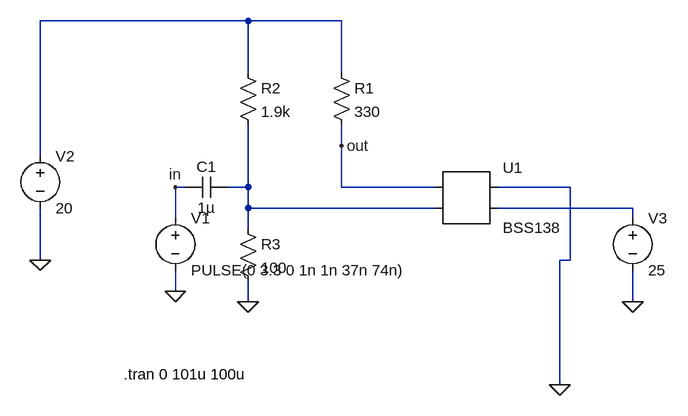
[diagram p0: schematic Draft1.asc]
Draft1.asc, the LTspice schematic file:
Version 4
SHEET 1 904 680
WIRE 64 -128 -256 -128
WIRE 208 -128 64 -128
WIRE 64 -48 64 -128
WIRE 208 -48 208 -128
WIRE 208 64 208 32
WIRE -256 80 -256 -128
WIRE -32 128 -48 128
WIRE 64 128 64 32
WIRE 64 128 32 128
WIRE 208 128 208 64
WIRE 352 128 208 128
WIRE 560 128 448 128
WIRE 64 160 64 128
WIRE 352 160 64 160
WIRE 656 160 448 160
WIRE -48 176 -48 128
WIRE 656 176 656 160
WIRE 64 192 64 160
WIRE -256 240 -256 160
WIRE 560 240 560 128
WIRE 560 240 544 240
WIRE -48 288 -48 256
WIRE 64 304 64 272
WIRE 656 304 656 256
WIRE 544 432 544 240
FLAG 544 432 0
FLAG -48 288 0
FLAG -256 240 0
FLAG 64 304 0
FLAG 208 64 out
FLAG -48 128 in
FLAG 656 304 0
SYMBOL res 192 -64 R0
SYMATTR InstName R1
SYMATTR Value 330
SYMBOL voltage -48 160 R0
WINDOW 123 0 0 Left 2
WINDOW 39 0 0 Left 2
SYMATTR InstName V1
SYMATTR Value PULSE(0 3.3 0 1n 1n 37n 74n)
SYMBOL voltage -256 64 R0
WINDOW 123 0 0 Left 2
WINDOW 39 0 0 Left 2
SYMATTR InstName V2
SYMATTR Value 20
SYMBOL res 48 -64 R0
SYMATTR InstName R2
SYMATTR Value 1.9k
SYMBOL res 48 176 R0
SYMATTR InstName R3
SYMATTR Value 100
SYMBOL cap 32 112 R90
WINDOW 0 0 32 VBottom 2
WINDOW 3 32 32 VTop 2
SYMATTR InstName C1
SYMATTR Value 1µ
SYMBOL AutoGenerated\\BSS138 400 144 R0
SYMATTR InstName U1
SYMBOL voltage 656 160 R0
WINDOW 123 0 0 Left 2
WINDOW 39 0 0 Left 2
SYMATTR InstName V3
SYMATTR Value 25
TEXT -128 416 Left 2 !.tran 0 101u 100u

The netlist it stands for:
* Draft1.asc
R1 N001 out 330
V1 in 0 PULSE(0 3.3 0 1n 1n 37n 74n)
V2 N001 0 20
R2 N001 N002 1.9k
R3 N002 0 100
C1 N002 in 1µ
* U1: BSS138 (symbol AutoGenerated\BSS138 not available, pins judged from their places): pin1=out pin2=N002 pin3=0 pin4=N003
V3 N003 0 25
.tran 0 101u 100u
.backanno
.end